# EAGLE schematic LB_BIT_w21_SUM-v03(2_0x) (EAGLE 6.5.0)
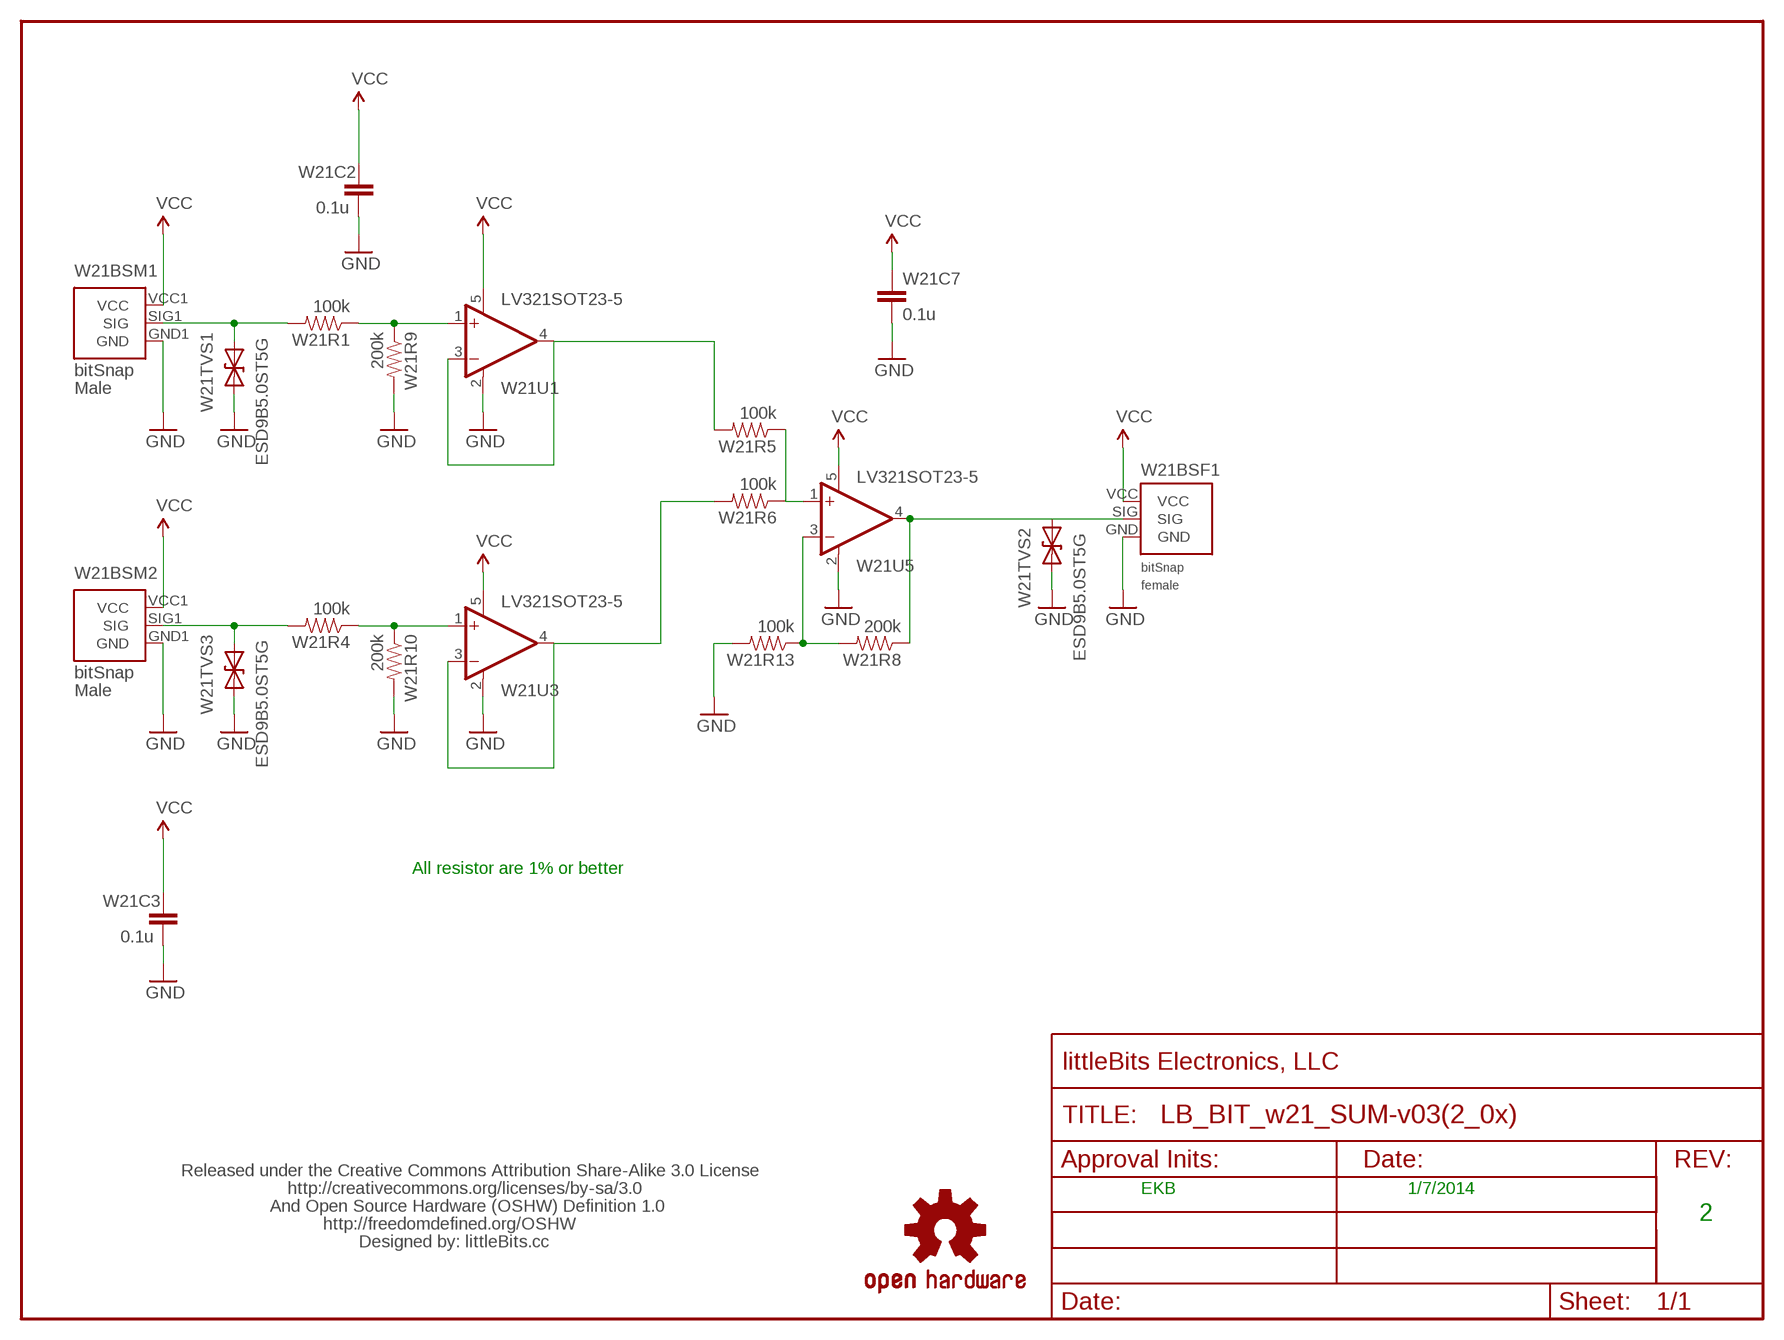
[diagram p0: schematic, sheet 1]

## Parts
FRAME1  FRAME-LETTER  [FABDWG01]
U$1  OSHWCREDIT  [OSHWCREDIT]
U$2  OSHW-LOGOL  [OSHW-LOGO-L]
W21BSF1  BITSNAP_V03_FEMALE  [BITSNAP_V03_FEMALE]
W21BSM1  BITSNAP_V03_MALE  [BITSNAP_V03_MALE]
W21BSM2  BITSNAP_V03_MALE  [BITSNAP_V03_MALE]
W21C2  0.1u  CAPCAP-0603  [CAP-0603]
W21C3  0.1u  CAPCAP-0603  [CAP-0603]
W21C7  0.1u  CAPCAP-0603  [CAP-0603]
W21R1  100k  RESISTOR0603  [RES-0603]
W21R4  100k  RESISTOR0603  [RES-0603]
W21R5  100k  RESISTOR0603  [RES-0603]
W21R6  100k  RESISTOR0603  [RES-0603]
W21R8  200k  RESISTOR0603  [RES-0603]
W21R9  200k  RESISTOR0603  [RES-0603]
W21R10  200k  RESISTOR0603  [RES-0603]
W21R13  100k  RESISTOR0603  [RES-0603]
W21TVS1  ESD9B5.0ST5G  DIODE-TVSSOD-923  [SOD-923]
W21TVS2  ESD9B5.0ST5G  DIODE-TVSSOD-923  [SOD-923]
W21TVS3  ESD9B5.0ST5G  DIODE-TVSSOD-923  [SOD-923]
W21U1  LV321SOT23-5  [SOT23-5]
W21U3  LV321SOT23-5  [SOT23-5]
W21U5  LV321SOT23-5  [SOT23-5]

## Nets
GND: W21BSF1.GND W21BSM1.GND1(GND) W21BSM2.GND1(GND) W21C2.2 W21C3.2 W21C7.2 W21R9.2 W21R10.2 W21R13.2 W21TVS1.1(A) W21TVS2.1(A) W21TVS3.1(A) W21U1.2(V-) W21U3.2(V-) W21U5.2(V-)
N$2: W21BSM2.SIG1(SIG) W21R4.2 W21TVS3.2(C)
N$3: W21R1.1 W21R9.1 W21U1.1(+IN)
N$4: W21R5.1 W21R6.1 W21U5.1(+IN)
N$5: W21BSM1.SIG1(SIG) W21R1.2 W21TVS1.2(C)
N$6: W21BSF1.SIG W21R8.1 W21TVS2.2(C) W21U5.4(OUT)
N$8: W21R5.2 W21U1.3(-IN) W21U1.4(OUT)
N$10: W21R4.1 W21R10.1 W21U3.1(+IN)
N$11: W21R6.2 W21U3.3(-IN) W21U3.4(OUT)
N$12: W21R8.2 W21R13.1 W21U5.3(-IN)
VCC: W21BSF1.VCC W21BSM1.VCC1(VCC) W21BSM2.VCC1(VCC) W21C2.1 W21C3.1 W21C7.1 W21U1.5(V+) W21U3.5(V+) W21U5.5(V+)

## Notes on the sheet
- All resistor are 1% or better
- EKB | 1/7/2014
- 2

## Library data of the parts
FRAME1 = LITTLEBITS:FRAME-LETTER: Schematic Frame Standard 8.5x11 US Letter frame
U$1 = LITTLEBITS:OSHWCREDIT
U$2 = LITTLEBITS:OSHW-LOGO: Open Source Hardware Logo This logo indicates the piece of hardware it is found on incorporates a OSHW license and/or adheres to the definition of open source hardware found here: http://freedomdefined.org/OSHW
W21BSF1 = bitSnap:BITSNAP_V03_FEMALE
W21BSM1 W21BSM2 = bitSnap:BITSNAP_V03_MALE
W21C2 W21C3 W21C7 = LITTLEBITS:CAP
W21R1 W21R4-W21R6 W21R8-W21R10 W21R13 = LITTLEBITS:RESISTOR
W21TVS1-W21TVS3 = LITTLEBITS:DIODE-TVS: Bidirectional Transient Voltage Suppression Diode: Device conducts in avalanche mode after reaching a part dependent voltage threshold. Used for limiting voltage spikes on ESD sensitive inputs and outputs.; IEC_ESD_PROT: +/-18kV; LB_PN: ?; V_CLAMP: ?; V_OPERATION: 5V
W21U1 W21U3 W21U5 = LITTLEBITS:LV321